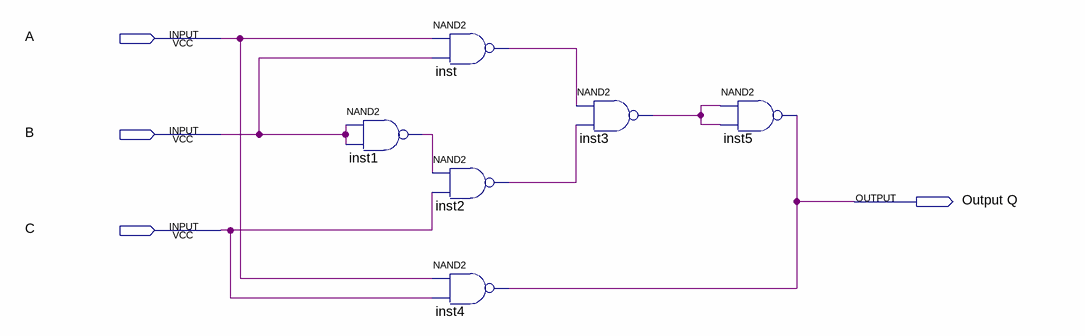
[diagram p0: schematic sheet]
// Quartus schematic ECE385_Lab1.bdf as structural Verilog: 6 symbols, 4 pins
module ECE385_Lab1 (
  input  A,
  input  B,
  input  C,
  output \Output_Q 
);

  wire inst1_out, inst2_out, inst3_out, inst_out;

  nand inst1 (inst1_out, B, B);
  nand inst (inst_out, A, B);
  nand inst2 (inst2_out, inst1_out, C);
  nand inst4 (\Output_Q , A, C);
  nand inst3 (inst3_out, inst_out, inst2_out);
  nand inst5 (\Output_Q , inst3_out, inst3_out);
endmodule
